# Altium schematic sheet Driver.SchDoc
size A4
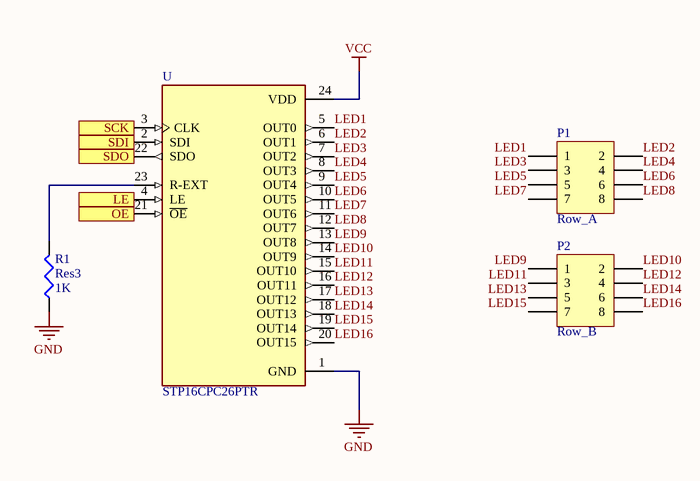
[diagram p0: Driver.SchDoc]

## Parts
P1  Row_A  [HDR2X4H]
P2  Row_B  [HDR2X4H]
R1  Res3  value 1K  [1608[0603]]
U  STP16CPC26PTR  [TSOP65P700X110_HS-25N]

## Ports
LE (in), OE (in), SCK (in), SDI (in), SDO (out)

## Nets
GND: R1.1 U.1(GND)
VCC: U.24(VDD)
LE: U.4(LE) ; port LE
LED1: P1.1 U.5(OUT0)
LED2: P1.2 U.6(OUT1)
LED3: P1.3 U.7(OUT2)
LED4: P1.4 U.8(OUT3)
LED5: P1.5 U.9(OUT4)
LED6: P1.6 U.10(OUT5)
LED7: P1.7 U.11(OUT6)
LED8: P1.8 U.12(OUT7)
LED9: P2.1 U.13(OUT8)
LED10: P2.2 U.14(OUT9)
LED11: P2.3 U.15(OUT10)
LED12: P2.4 U.16(OUT11)
LED13: P2.5 U.17(OUT12)
LED14: P2.6 U.18(OUT13)
LED15: P2.7 U.19(OUT14)
LED16: P2.8 U.20(OUT15)
OE: U.21(~{OE}) ; port OE
SCK: U.3(CLK) ; port SCK
SDI: U.2(SDI) ; port SDI
SDO: U.22(SDO) ; port SDO
NetR1_2: R1.2 U.23(R-EXT)

## Library data of the parts
P1 P2 = Header 4X2H: Header, 4-Pin, Dual row, Right Angle; LatestRevisionDate: 17-Jul-2002; LatestRevisionNote: Re-released for DXP Platform.; Publisher: Altium Limited
R1 = Res3: Resistor; Published: 8-Jun-2000; LatestRevisionDate: 29-May-2009; LatestRevisionNote: IPC-7351 Footprint Added.; PackageReference: J1-0603; Publisher: Altium Limited; PackageDescription: Chip Resistor
U = STP16CPC26PTR: LED Driver IC 16 Output Linear Shift Register Analog Dimming 90mA 24-QSOP; MF: STMicroelectronics; Package: QSOP-24 STMicroelectronics; Value: *; MP: STP16CPC26PTR; Availability: Unavailable; SnapEDA_Link: https://www.snapeda.com/parts/STP16CPC26PTR/STMicroelectronics/view-part/314081/?ref=snap; Price: None